# EAGLE design Compass (EAGLE 9.1.2)
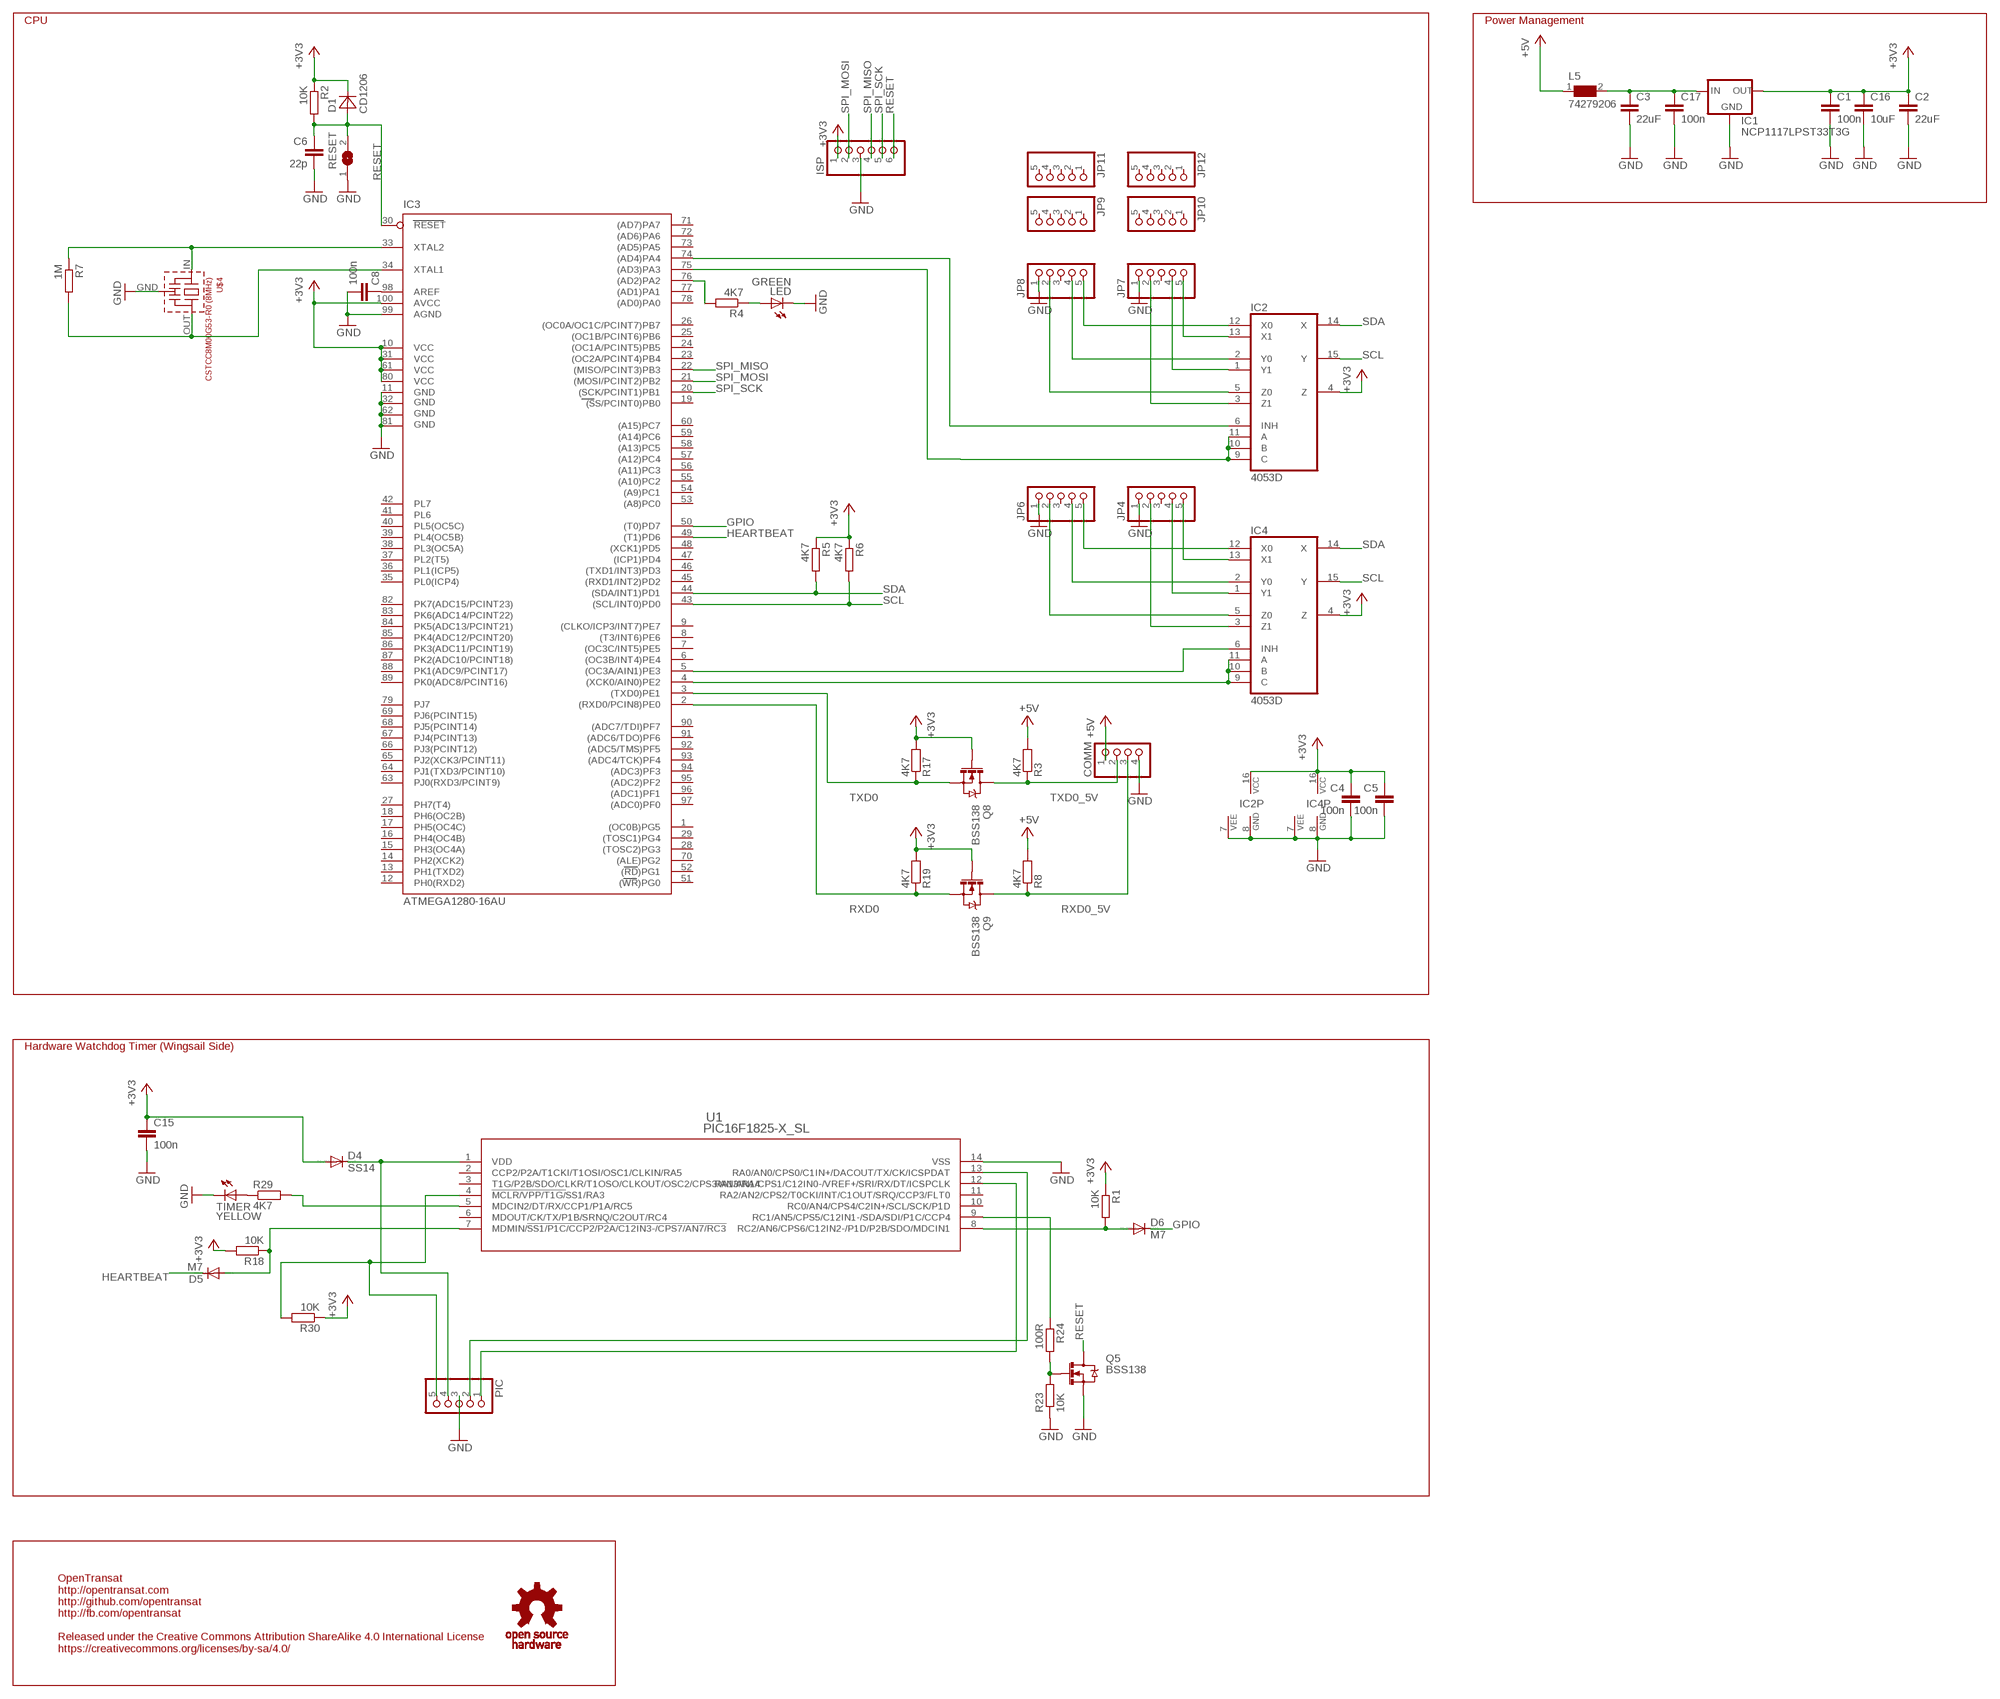
[diagram p0: schematic, sheet 1]

## Parts
C1  100n  C-EUC0603  [C0603]
C2  22uF  C-EUC1210  [C1210]
C3  22uF  C-EUC1210  [C1210]
C4  100n  C-EUC0603  [C0603]
C5  100n  C-EUC0603  [C0603]
C6  22p  C-EUC0603  [C0603]
C8  100n  C-EUC0603  [C0603]
C15  100n  C-EUC0603  [C0603]
C16  10uF  C-EUC1206  [C1206]
C17  100n  C-EUC0603  [C0603]
COMM  PINHD-1X4/90  [1X04/90]
D1  CD1206  [R1206]
D4  SS14  DIODE-DO214AC  [DO214AC]
D5  M7  DIODE-DO-214AC  [DO-214AC]
D6  M7  DIODE-DO-214AC  [DO-214AC]
IC1  NCP1117LPST33T3G  LM1117MP-3.3  [SOT223]
IC2  4053D  [SO16]
IC3  ATMEGA1280-16AU  [TQFP100]
IC4  4053D  [SO16]
ISP  PINHD-1X6/90  [1X06/90]
JP4  PINHD-1X5  [1X05]
JP6  PINHD-1X5  [1X05]
JP7  PINHD-1X5  [1X05]
JP8  PINHD-1X5  [1X05]
JP9  PINHD-1X5  [1X05]
JP10  PINHD-1X5  [1X05]
JP11  PINHD-1X5  [1X05]
JP12  PINHD-1X5  [1X05]
L5  74279206  WE-CBF_0805  [0805]
LED  GREEN  LEDCHIPLED_0805  [CHIPLED_0805]
PIC  PINHD-1X5/90  [1X05/90]
Q5  BSS138  MOSFET-NCHANNEL_SOT23-3  [SOT23-3]
Q8  BSS138  MOSFET-NCHANNEL_SOT23-3  [SOT23-3]
Q9  BSS138  MOSFET-NCHANNEL_SOT23-3  [SOT23-3]
R1  10K  R-EU_R0603  [R0603]
R2  10K  R-EU_R0603  [R0603]
R3  4K7  R-EU_R0603  [R0603]
R4  4K7  R-EU_R0603  [R0603]
R5  4K7  R-EU_R0603  [R0603]
R6  4K7  R-EU_R0603  [R0603]
R7  1M  R-EU_R0603  [R0603]
R8  4K7  R-EU_R0603  [R0603]
R17  4K7  R-EU_R0603  [R0603]
R18  10K  R-EU_R0603  [R0603]
R19  4K7  R-EU_R0603  [R0603]
R23  10K  R-EU_R0603  [R0603]
R24  100R  R-EU_R0603  [R0603]
R29  4K7  R-EU_R0603  [R0603]
R30  10K  R-EU_R0603  [R0603]
RESET  SJW  [SJW]
TIMER  YELLOW  LEDCHIPLED_0805  [CHIPLED_0805]
U1  PIC16F1825-X_SL  [SOIC14-N_MC]
U$1  OSHW_S  [OSHWS]
U$4  CSTCC8M00G53-R0 (8MHz)  CSTCC  [CSTCC]

## Nets
+3V3: C1.1 C2.1 C4.1 C5.1 C15.1 C16.1 D1.2(C) D4.A IC1.2(OUT) IC1.4(OUT) IC2.4(Z) IC2.16(VCC) IC3.10(VCC) IC3.31(VCC1) IC3.61(VCC2) IC3.80(VCC3) IC3.100(AVCC) IC4.4(Z) IC4.16(VCC) ISP.1 Q8.1(G) Q9.1(G) R1.1 R2.1 R5.1 R6.1 R17.2 R18.2 R19.2 R30.1
+5V: COMM.1 L5.1 R3.2 R8.2
GND [1A]: C1.2 C2.2 C3.2 C4.2 C5.2 C6.2 C8.2 C15.2 C16.2 C17.2 COMM.4 IC1.1(GND) IC2.7(VEE) IC2.8(GND) IC3.11(GND) IC3.32(GND1) IC3.62(GND2) IC3.81(GND3) IC3.99(AGND) IC4.7(VEE) IC4.8(GND) ISP.3 JP4.1 JP6.1 JP7.1 JP8.1 LED.C PIC.3 Q5.2(S) R23.1 RESET.1 TIMER.C U1.14(VSS) U$4.GND
GPIO: D6.C IC3.50((T0)PD7)
HEARTBEAT: D5.C IC3.49((T1)PD6)
N$1: C3.1 C17.1 IC1.3(IN) L5.2
N$2: D6.A R1.2 U1.8(RC2/AN6/CPS6/C12IN2-/P1D/P2B/SDO/MDCIN1)
N$3: C8.1 IC3.98(AREF)
N$4: IC4.3(Z1) JP4.2
N$5: LED.A R4.1
N$6: IC4.1(Y1) JP4.4
N$7: IC3.76((AD2)PA2) R4.2
N$10: IC3.4((XCK0/AIN0)PE2) IC4.9(C) IC4.10(B) IC4.11(A)
N$11: IC3.5((OC3A/AIN1)PE3) IC4.6(INH)
N$12: IC4.13(X1) JP4.5
N$13: IC4.12(X0) JP6.5
N$14: IC4.2(Y0) JP6.4
N$15: IC4.5(Z0) JP6.2
N$16: IC2.9(C) IC2.10(B) IC2.11(A) IC3.75((AD3)PA3)
N$17: IC2.6(INH) IC3.74((AD4)PA4)
N$18: IC2.3(Z1) JP7.2
N$19: IC2.1(Y1) JP7.4
N$20: IC2.13(X1) JP7.5
N$21: IC2.12(X0) JP8.5
N$22: IC2.2(Y0) JP8.4
N$23: IC2.5(Z0) JP8.2
N$26: D5.A R18.1 U1.7(MDMIN/!SS1/P1C/CCP2/P2A/C12IN3-/CPS7/AN7/RC3)
N$30: PIC.2 U1.13(RA0/AN0/CPS0/C1IN+/DACOUT/TX/CK/ICSPDAT)
N$36: PIC.5 R30.2 U1.4(!MCLR/VPP/T1G/!SS1/RA3)
N$37: PIC.1 U1.12(RA1/AN1/CPS1/C12IN0-/VREF+/SRI/RX/DT/ICSPCLK)
N$41: D4.C PIC.4 U1.1(VDD)
N$42: R24.1 U1.9(RC1/AN5/CPS5/C12IN1-/SDA/SDI/P1C/CCP4)
N$46: Q5.1(G) R23.2 R24.2
N$51: R29.2 U1.5(MDCIN2/DT/RX/CCP1/P1A/RC5)
N$52: R29.1 TIMER.A
RESET: C6.1 D1.1(A) IC3.30(RESET) ISP.6 Q5.3(D) R2.2 RESET.2
RXD0: IC3.2((RXD0/PCIN8)PE0) Q9.2(S) R19.1
RXD0_5V: COMM.3 Q9.3(D) R8.1
SCL: IC2.15(Y) IC3.43((SCL/INT0)PD0) IC4.15(Y) R6.2
SDA: IC2.14(X) IC3.44((SDA/INT1)PD1) IC4.14(X) R5.2
SPI_MISO: IC3.22((MISO/PCINT3)PB3) ISP.4
SPI_MOSI: IC3.21((MOSI/PCINT2)PB2) ISP.2
SPI_SCK: IC3.20((SCK/PCINT1)PB1) ISP.5
TXD0: IC3.3((TXD0)PE1) Q8.2(S) R17.1
TXD0_5V: COMM.2 Q8.3(D) R3.1
XTAL3: IC3.33(XTAL2) R7.1 U$4.IN
XTAL4: IC3.34(XTAL1) R7.2 U$4.OUT
Unconnected: IC3.1((OC0B)PG5) IC3.6((OC3B/INT4)PE4) IC3.7((OC3C/INT5)PE5) IC3.8((T3/INT6)PE6) IC3.9((CLKO/ICP3/INT7)PE7) IC3.12(PH0(RXD2)) IC3.13(PH1(TXD2)) IC3.14(PH2(XCK2)) IC3.15(PH3(OC4A)) IC3.16(PH4(OC4B)) IC3.17(PH5(OC4C)) IC3.18(PH6(OC2B)) IC3.19((SS/PCINT0)PB0) IC3.23((OC2A/PCINT4)PB4) IC3.24((OC1A/PCINT5)PB5) IC3.25((OC1B/PCINT6)PB6) IC3.26((OC0A/OC1C/PCINT7)PB7) IC3.27(PH7(T4)) IC3.28((TOSC2)PG3) IC3.29((TOSC1)PG4) IC3.35(PL0(ICP4)) IC3.36(PL1(ICP5)) IC3.37(PL2(T5)) IC3.38(PL3(OC5A)) IC3.39(PL4(OC5B)) IC3.40(PL5(OC5C)) IC3.41(PL6) IC3.42(PL7) IC3.45((RXD1/INT2)PD2) IC3.46((TXD1/INT3)PD3) IC3.47((ICP1)PD4) IC3.48((XCK1)PD5) IC3.51((WR)PG0) IC3.52((RD)PG1) IC3.53((A8)PC0) IC3.54((A9)PC1) IC3.55((A10)PC2) IC3.56((A11)PC3) IC3.57((A12)PC4) IC3.58((A13)PC5) IC3.59((A14)PC6) IC3.60((A15)PC7) IC3.63(PJ0(RXD3/PCINT9)) IC3.64(PJ1(TXD3/PCINT10)) IC3.65(PJ2(XCK3/PCINT11)) IC3.66(PJ3(PCINT12)) IC3.67(PJ4(PCINT13)) IC3.68(PJ5(PCINT14)) IC3.69(PJ6(PCINT15)) IC3.70((ALE)PG2) IC3.71((AD7)PA7) IC3.72((AD6)PA6) IC3.73((AD5)PA5) IC3.77((AD1)PA1) IC3.78((AD0)PA0) IC3.79(PJ7) IC3.82(PK7(ADC15/PCINT23)) IC3.83(PK6(ADC14/PCINT22)) IC3.84(PK5(ADC13/PCINT21)) IC3.85(PK4(ADC12/PCINT20)) IC3.86(PK3(ADC11/PCINT19)) IC3.87(PK2(ADC10/PCINT18)) IC3.88(PK1(ADC9/PCINT17)) IC3.89(PK0(ADC8/PCINT16)) IC3.90((ADC7/TDI)PF7) IC3.91((ADC6/TDO)PF6) IC3.92((ADC5/TMS)PF5) IC3.93((ADC4/TCK)PF4) IC3.94((ADC3)PF3) IC3.95((ADC2)PF2) IC3.96((ADC1)PF1) IC3.97((ADC0)PF0) JP4.3 JP6.3 JP7.3 JP8.3 JP9.1 JP9.2 JP9.3 JP9.4 JP9.5 JP10.1 JP10.2 JP10.3 JP10.4 JP10.5 JP11.1 JP11.2 JP11.3 JP11.4 JP11.5 JP12.1 JP12.2 JP12.3 JP12.4 JP12.5 U1.2(CCP2/P2A/T1CKI/T1OSI/OSC1/CLKIN/RA5) U1.3(T1G/P2B/SDO/CLKR/T1OSO/CLKOUT/OSC2/CPS3/AN3/RA4) U1.6(MDOUT/CK/TX/P1B/SRNQ/C2OUT/RC4) U1.10(RC0/AN4/CPS4/C2IN+/SCL/SCK/P1D) U1.11(RA2/AN2/CPS2/T0CKI/INT/C1OUT/SRQ/CCP3/FLT0)

## Notes on the sheet
- CPU | Power Management
- Hardware Watchdog Timer (Wingsail Side)
- OpenTransat
  http://opentransat.com
  http://github.com/opentransat
  http://fb.com/opentransat
  
  Released under the Creative Commons Attribution ShareAlike 4.0 International License
  https://creativecommons.org/licenses/by-sa/4.0/

## Library data of the parts
C1-C6 C8 C15-C17 = rcl:C-EU: CAPACITOR, European symbol; SPICEPREFIX: C
COMM = pinhead:PINHD-1X4: PIN HEADER
D1 = diodes_smd:CD1206
D4-D6 = diode:DIODE-: DIODE
IC1 = lm1117_10:LM1117?-*: 800mA Low-Dropout Linear Regulator Source: http://www.ti.com/lit/ds/symlink/lm1117-n.pdf; MF: Texas Instruments; MPN: LM1117MP-3.3; OC_FARNELL: 9778195; OC_NEWARK: 28X3416
IC2 IC4 = 40xx:4053: Triple 2-channel ANALOG MULTIPLEXER
IC3 = atmel-2005:ATMEGA*: MICROCONTROLLER 64/128/256 Kbytes FLASH 4 Kbytes EEPROM 8 Kbytes SRAM 86 General Purpose I/O pins 12-channels16-bit PWM 4 x Serial USARTs 16-channels 10-bit A/D
ISP = pinhead:PINHD-1X6: PIN HEADER
JP4 JP6-JP12 PIC = pinhead:PINHD-1X5: PIN HEADER
L5 = Wurth_Elektronik_Passive_rev15b:WE-CBF: SMD EMI Suppression Ferrite Beads WE-CBF - Excellent anti-EMI properties - Low DC-restistance - Impedances till 3000 ohms - Rated current up to 6 A -- Reliable Ni-Sn electrodes -- Perfect as data lined filter and for uncoupling of distribution voltage <http://katalog.we-online.de/media/images/eisos/FeCBF_pf2.jpg> Details see: http://katalog.we-online.de/en/pbs/WE-CBF updated by Dan Xu 2014-06-19 2014 (C) Würth Elektronik
LED TIMER = led:LED: LED OSRAM: - CHIPLED LG R971, LG N971, LY N971, LG Q971, LY Q971, LO R971, LY R971 LH N974, LH R974 LS Q976, LO Q976, LY Q976 LO Q996 - Hyper CHIPLED LW Q18S LB Q993, LB Q99A, LB R99A - SideLED LS A670, LO A670, LY A670, LG A670, LP A670 LB A673, LV A673, LT A673, LW A673 LH A674 LY A675 LS A676, LA A676, LO A676, LY A676, LW A676 LS A679, LY A679, LG A679 - Hyper Micro SIDELED® LS Y876, LA Y876, LO Y876, LY Y876 LT Y87S - SmartLED LW L88C, LW L88S LB L89C, LB L89S, LG L890 LS L89K, LO L89K, LY L89K LS L896, LA L896, LO L896, LY L896 - TOPLED LS T670, LO T670, LY T670, LG T670, LP T670 LSG T670, LSP T670, LSY T670, LOP T670, LYG T670 LG T671, LOG T671, LSG T671 LB T673, LV T673, LT T673, LW T673 LH T674 LS T676, LA T676, LO T676, LY T676, LB T676, LH T676, LSB T676, LW T676 LB T67C, LV T67C, LT T67C, LS T67K, LO T67K, LY T67K, LW E67C LS E67B, LA E67B, LO E67B, LY E67B, LB E67C, LV E67C, LT E67C LW T67C LS T679, LY T679, LG T679 LS T770, LO T770, LY T770, LG T770, LP T770 LB T773, LV T773, LT T773, LW T773 LH T774 LS E675, LA E675, LY E675, LS T675 LS T776, LA T776, LO T776, LY T776, LB T776 LHGB T686 LT T68C, LB T68C - Hyper Mini TOPLED® LB M676 - Mini TOPLED Santana® LG M470 LS M47K, LO M47K, LY M47K Source: http://www.osram.convergy.de LUXEON: - LUMILED® LXK2-PW12-R00, LXK2-PW12-S00, LXK2-PW14-U00, LXK2-PW14-V00 LXK2-PM12-R00, LXK2-PM12-S00, LXK2-PM14-U00 LXK2-PE12-Q00, LXK2-PE12-R00, LXK2-PE12-S00, LXK2-PE14-T00, LXK2-PE14-U00 LXK2-PB12-K00, LXK2-PB12-L00, LXK2-PB12-M00, LXK2-PB14-N00, LXK2-PB14-P00, LXK2-PB14-Q00 LXK2-PR12-L00, LXK2-PR12-M00, LXK2-PR14-Q00, LXK2-PR14-R00 LXK2-PD12-Q00, LXK2-PD12-R00, LXK2-PD12-S00 LXK2-PH12-R00, LXK2-PH12-S00 LXK2-PL12-P00, LXK2-PL12-Q00, LXK2-PL12-R00 Source: www.luxeon.com KINGBRIGHT: KA-3528ASYC Source: www.kingbright.com
Q5 Q8 Q9 = Simplex-DiscreteSemi:MOSFET-NCHANNEL: Generic N-channel mosfet
R1-R8 R17-R19 R23 R24 R29 R30 = rcl:R-EU_: RESISTOR, European symbol
RESET = jumper:SJ: SMD solder JUMPER
U1 = PIC16F1825:PIC16F1825-X_SL
U$1 = oshw:OSHW_S
U$4 = murata-cstcc-cstcv-resonators:CSTCC: Murata CSTCC Resonator - 7,2 x 3,0 mm

## Board
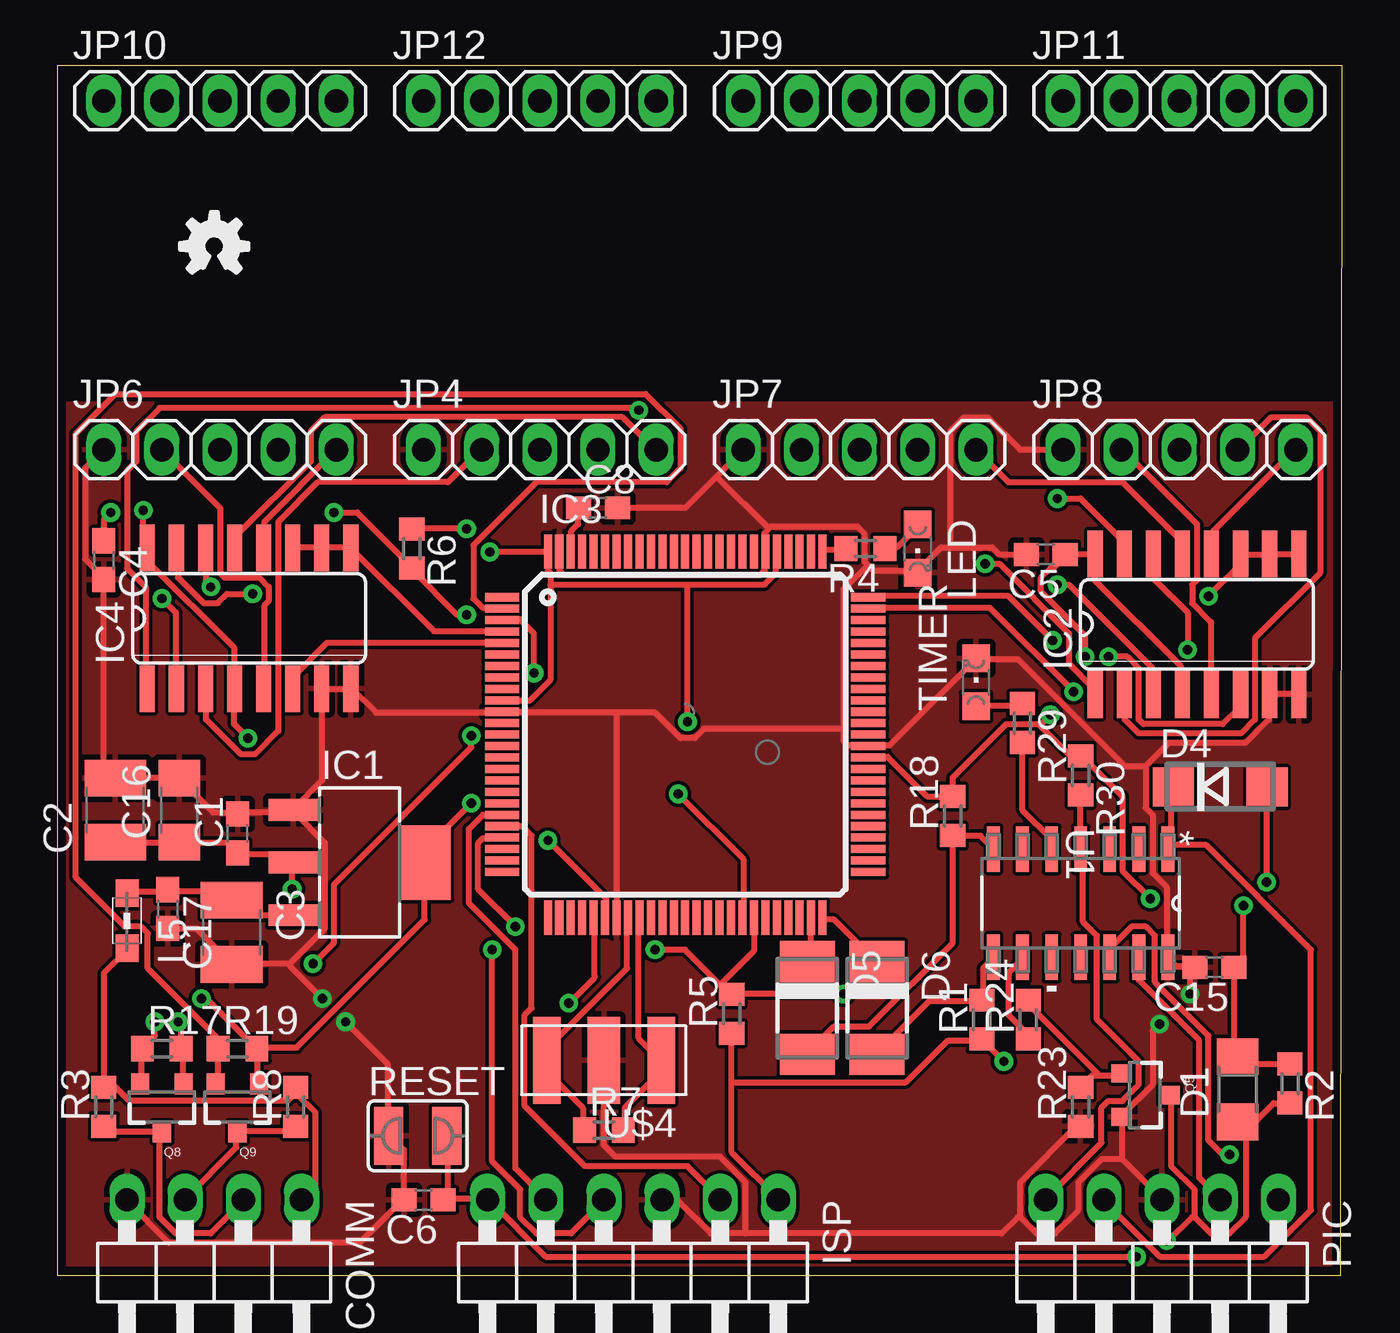
[diagram p1: board, top side]
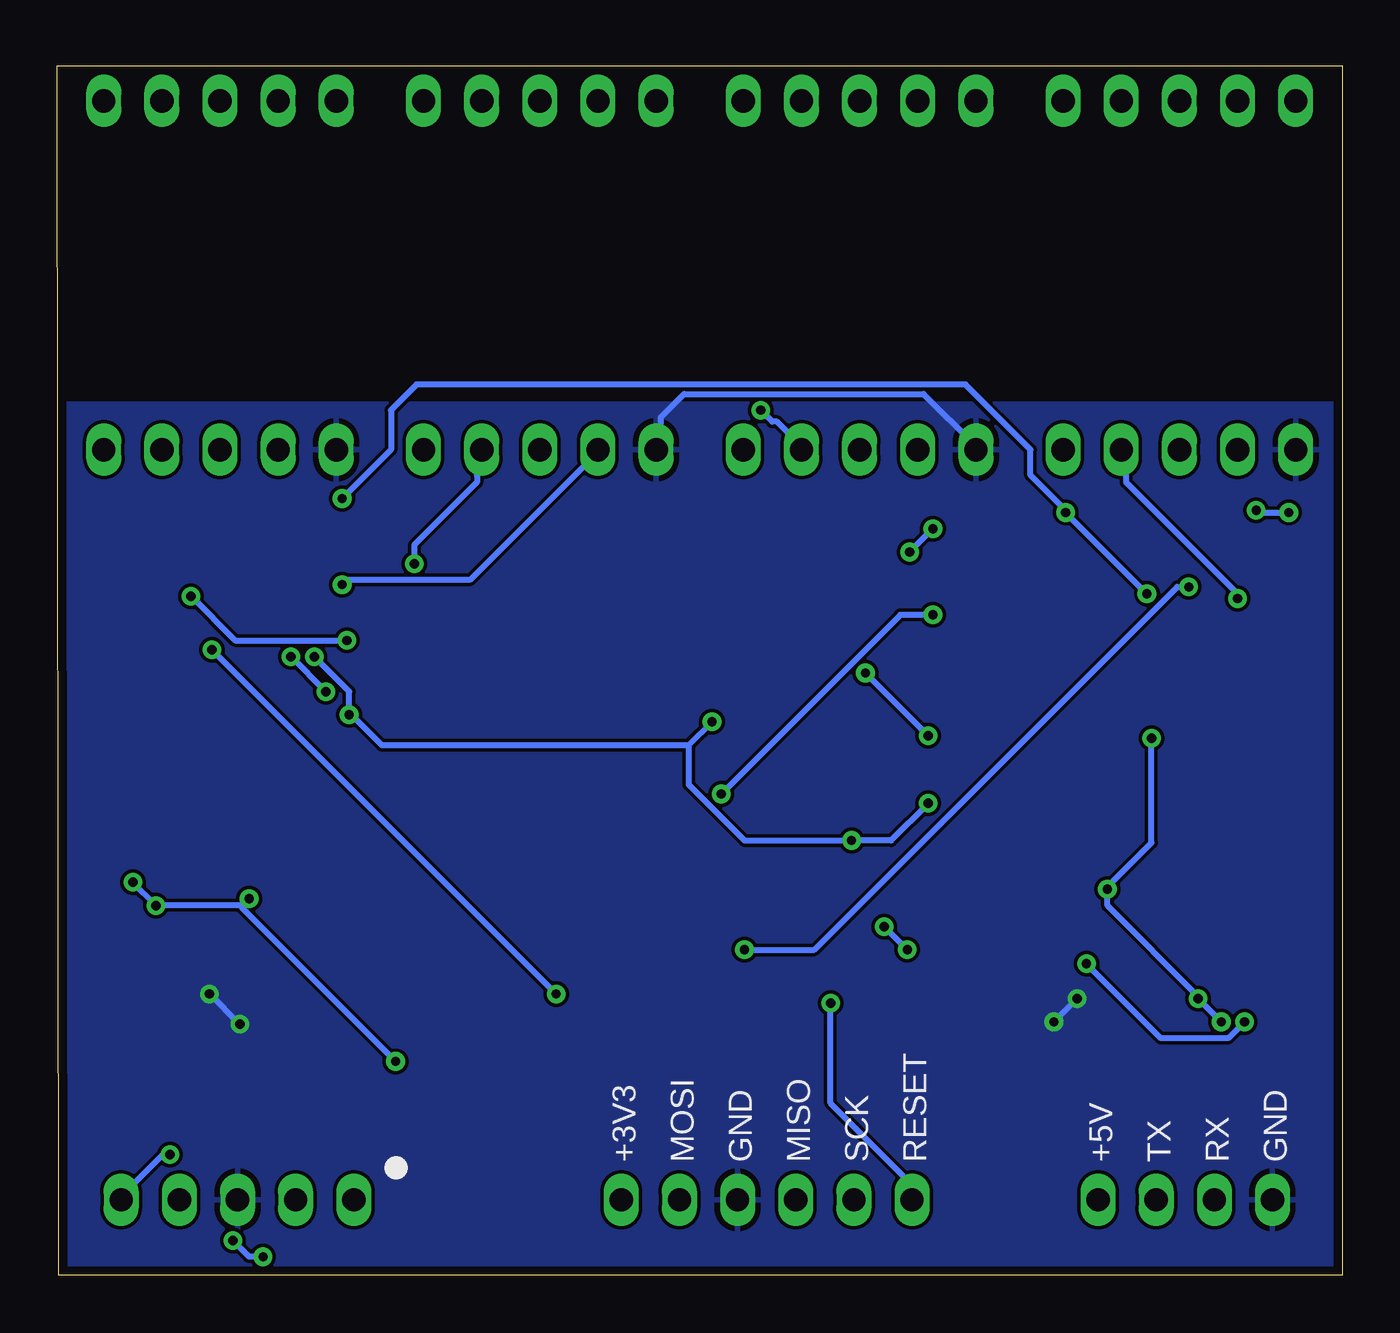
[diagram p2: board, bottom side, seen from below]

Size 56.13 x 52.83 mm. Coordinates in mm from the lower left corner, seen from the top.
Outline: 0,0 56.06,0 56.13,52.83 0,52.83 0,0
Copper layers (1*16): Top 0.035mm / dielectric 1.5mm / Bottom 0.035mm
Design rules "autorouter *": minimum track width 10mil, minimum drill 16mil, track to track 6mil, track to pad 6mil, pad to pad 6mil, via to via 7mil, smd to smd 6mil, copper to edge 15mil, drill to drill 12mil, minimum pad ring 10mil, minimum via ring 8mil, stop-mask expansion 1mil, vias tented up to drill 30mil, thermal gap 10mil

### Footprints (pad centres in the part's own frame; a part is rotated, then mirrored left to right if it is on the bottom)
C0603 = smd 1.1 x 1: 1 -0.85,0; 2 0.85,0
C1210 = smd 1.6 x 2.7: 1 -1.4,0; 2 1.4,0
C1206 = smd 1.6 x 1.8: 1 -1.4,0; 2 1.4,0
1X04/90 = drill 1.016 long: 1 -3.81,-3.81; 2 -1.27,-3.81; 3 1.27,-3.81; 4 3.81,-3.81
R1206 = smd 1.6 x 1.803: 1 -1.422,0; 2 1.422,0
DO214AC = smd 1.8 x 1.7: A 2.05,0; C -2.05,0
DO-214AC = smd 1.8 x 2.4: A 2.025,0; C -2.025,0
SOT223 = smd 0.95 x 2.15: 1 -2.3,-2.9; 2 0,-2.9; 3 2.3,-2.9 | smd 3.25 x 2.15: 4 0,2.9
SO16 = smd 0.66 x 2.032: 1 -4.445,-3.073; 2 -3.175,-3.073; 3 -1.905,-3.073; 4 -0.635,-3.073; 5 0.635,-3.073; 6 1.905,-3.073; 7 3.175,-3.073; 8 4.445,-3.073; 9 4.445,3.073; 10 3.175,3.073; 11 1.905,3.073; 12 0.635,3.073; 13 -0.635,3.073; 14 -1.905,3.073; 15 -3.175,3.073; 16 -4.445,3.073
TQFP100 = smd 1.5 x 0.35: 1 -8,6; 2 -8,5.5; 3 -8,5; 4 -8,4.5; 5 -8,4; 6 -8,3.5; 7 -8,3; 8 -8,2.5; 9 -8,2; 10 -8,1.5; 11 -8,1; 12 -8,0.5; 13 -8,0; 14 -8,-0.5; 15 -8,-1; 16 -8,-1.5; 17 -8,-2; 18 -8,-2.5; 19 -8,-3; 20 -8,-3.5; 21 -8,-4; 22 -8,-4.5; 23 -8,-5; 24 -8,-5.5; 25 -8,-6; 51 8,-6; 52 8,-5.5; 53 8,-5; 54 8,-4.5; 55 8,-4; 56 8,-3.5; 57 8,-3; 58 8,-2.5; 59 8,-2; 60 8,-1.5; 61 8,-1; 62 8,-0.5; 63 8,0; 64 8,0.5; 65 8,1; 66 8,1.5; 67 8,2; 68 8,2.5; 69 8,3; 70 8,3.5; 71 8,4; 72 8,4.5; 73 8,5; 74 8,5.5; 75 8,6 | smd 0.35 x 1.5: 26 -6,-8; 27 -5.5,-8; 28 -5,-8; 29 -4.5,-8; 30 -4,-8; 31 -3.5,-8; 32 -3,-8; 33 -2.5,-8; 34 -2,-8; 35 -1.5,-8; 36 -1,-8; 37 -0.5,-8; 38 0,-8; 39 0.5,-8; 40 1,-8; 41 1.5,-8; 42 2,-8; 43 2.5,-8; 44 3,-8; 45 3.5,-8; 46 4,-8; 47 4.5,-8; 48 5,-8; 49 5.5,-8; 50 6,-8; 76 6,8; 77 5.5,8; 78 5,8; 79 4.5,8; 80 4,8; 81 3.5,8; 82 3,8; 83 2.5,8; 84 2,8; 85 1.5,8; 86 1,8; 87 0.5,8; 88 0,8; 89 -0.5,8; 90 -1,8; 91 -1.5,8; 92 -2,8; 93 -2.5,8; 94 -3,8; 95 -3.5,8; 96 -4,8; 97 -4.5,8; 98 -5,8; 99 -5.5,8; 100 -6,8
1X06/90 = drill 1.016 long: 1 -6.35,-3.81; 2 -3.81,-3.81; 3 -1.27,-3.81; 4 1.27,-3.81; 5 3.81,-3.81; 6 6.35,-3.81
1X05 = drill 1.016 long: 1 -5.08,0; 2 -2.54,0; 3 0,0; 4 2.54,0; 5 5.08,0
0805 = smd 1.2 x 1: 1 -1.2,0; 2 1.2,0
CHIPLED_0805 = smd 1.2 x 1.2: A 0,-1.05; C 0,1.05
1X05/90 = drill 1.016 long: 1 -5.08,-3.81; 2 -2.54,-3.81; 3 0,-3.81; 4 2.54,-3.81; 5 5.08,-3.81
SOT23-3 = smd 0.8 x 0.9: 1 -0.95,-1; 2 0.95,-1; 3 0,1.1
R0603 = smd 1 x 1.1: 1 -0.85,0; 2 0.85,0
SJW = smd 1.27 x 2.54: 1 -1.27,0; 2 1.27,0
SOIC14-N_MC = smd 1.981 x 0.559: 1 -2.362,3.81; 2 -2.362,2.54; 3 -2.362,1.27; 4 -2.362,0; 5 -2.362,-1.27; 6 -2.362,-2.54; 7 -2.362,-3.81; 8 2.362,-3.81; 9 2.362,-2.54; 10 2.362,-1.27; 11 2.362,0; 12 2.362,1.27; 13 2.362,2.54; 14 2.362,3.81
CSTCC = smd 1.4 x 3.8: GND 0,0 | smd 1.2 x 3.8: IN 2.5,0; OUT -2.5,0

### Placement (x,y rotation side)
C1  7.87,19.3 90 top
C2  2.54,20.32 90 top
C3  7.62,14.99 270 top
C4  2.03,31.24 270 top
C5  43.18,31.5 180 top
C6  16,3.3 180 top
C8  23.62,33.53 0 top
C15  50.55,13.46 180 top
C16  5.33,20.32 90 top
C17  4.83,16 270 top
COMM  6.86,-0.51 180 top
D1  51.56,8.13 90 top
D4  50.8,21.34 0 top
D5  32.77,11.68 270 top
D6  35.81,11.68 270 top
IC1  13.21,18.03 270 top
IC2  49.78,28.45 0 top
IC3  27.43,23.62 0 top
IC4  8.38,28.7 0 top
ISP  25.15,-0.51 180 top
JP4  21.08,36.07 0 top
JP6  7.11,36.07 0 top
JP7  35.05,36.07 0 top
JP8  49.02,36.07 0 top
JP9  35.05,51.31 0 top
JP10  7.11,51.31 0 top
JP11  49.02,51.31 0 top
JP12  21.08,51.31 0 top
L5  3.05,15.49 90 top
LED  37.59,31.75 180 top
PIC  48.26,-0.51 180 top
Q5  47.5,7.87 270 top
Q8  4.57,7.37 180 top
Q9  7.87,7.37 180 top
R1  40.39,11.18 90 top
R2  53.85,8.38 270 top
R3  2.03,7.37 90 top
R4  35.31,31.75 180 top
R5  29.46,11.43 90 top
R6  15.49,31.75 270 top
R7  23.88,6.35 0 top
R8  10.41,7.37 90 top
R17  4.57,9.91 0 top
R18  39.12,20.07 90 top
R19  7.87,9.91 0 top
R23  44.7,7.37 90 top
R24  42.42,11.18 90 top
R29  42.16,24.13 270 top
R30  44.7,21.84 270 top
RESET  15.75,6.1 0 top
TIMER  40.13,25.91 0 top
U1  44.7,16.26 270 top
U$1  6.86,44.96 0 top
U$4  23.88,9.4 180 top

### Tracks (layer width: path | path; a pad name or v marks a point on that pad's centre or on a via)
+3V3  (via drill 0.41)
  Top 0.254: C4.1 2.03,33.02 v2.34,33.33 | v3.76,33.43 3.76,31.9 3.86,31.8 IC4.16 3.96,31.7 3.96,31.19 7.72,27.43 7.72,25.7 IC4.4 7.72,25.5 7.72,24.08 v8.33,23.47 | C2.1 2.54,18.9 5.28,18.9 C16.1 5.38,18.9 7.42,18.9 7.82,18.49 C1.1 7.92,18.39 9.96,18.39 10.26,18.09 IC1.2 10.26,17.98 v10.26,16.87 | Q8.1 5.49,8.43 5.49,9.86 R17.2 5.38,9.96 5.38,10.97 v5.28,11.07 | Q9.1 8.74,8.43 8.74,9.86 R19.2 | v6.3,12.09 6.5,12.09 8.64,9.96 R19.2 | R19.2 8.84,9.96 10.46,9.96 16.05,15.54 16.05,17.98 IC1.4 16.15,18.09 16.15,18.69 v18.09,20.62 | v17.88,32.61 15.54,32.61 R6.1 | v18.9,31.6 21.34,31.6 IC3.100 21.44,31.5 21.44,30.79 21.54,30.68 21.54,30.18 | 21.54,30.18 21.54,26.01 20.62,25.09 19.51,25.09 IC3.10 | 21.54,30.18 27.53,30.18 | 27.53,30.18 30.89,30.18 31.39,30.68 31.39,31.6 IC3.80 | 29.46,8.43 29.46,5.38 31.5,3.35 ISP.1 | 29.46,8.43 R5.1 | 29.46,8.43 37.08,8.43 38.91,10.26 40.34,10.26 R1.1 40.44,10.26 v41.35,9.35 | R2.1 53.85,9.25 51.82,9.25 51.61,9.45 D1.2 51.51,9.65 51.41,9.75 51.41,13.41 C15.1 51.51,13.51 51.82,13.82 v51.82,16.15 | v52.83,17.17 52.83,21.34 D4.A | IC2.4 49.07,25.4 49.07,26.62 45.31,30.38 45.31,31.39 IC2.16 45.31,31.5 C5.1 43.99,31.39 43.48,30.89 43.38,30.89 42.98,30.48 42.98,29.87 44.91,27.94 v44.91,27.03 | IC3.61 35.46,22.66 36.27,22.66 38,20.93 R18.2 39.12,21.74 41.45,24.08 42.88,24.08 42.93,24.03 | 42.93,24.03 44.2,22.76 44.7,22.76 R30.1 44.81,22.66 46.53,20.93 46.53,17.68 v47.75,16.46 | 42.93,24.03 v43.38,24.49 | v27.53,24.18 27.53,30.18 | v21.44,19 23.98,16.46 23.98,15.65 IC3.31
  Bottom 0.254: v2.34,33.33 3.66,33.33 v3.76,33.43 | v5.28,11.07 v6.3,12.09 6.3,12.19 10.26,16.15 v10.26,16.87 10.26,16.97 8.33,18.9 v8.33,23.47 | v18.9,31.6 v17.88,32.61 | v52.83,17.17 v51.82,16.15 48.06,16.15 | v44.91,27.03 43.38,25.5 v43.38,24.49 43.28,24.49 41.96,23.16 28.65,23.16 28.55,23.16 | v47.75,16.46 48.06,16.15 | v41.35,9.35 48.06,16.05 48.06,16.15 | v18.09,20.62 19.71,19 v21.44,19 21.54,19 26.11,19 28.55,21.44 28.55,21.54 28.55,23.16 | v27.53,24.18 28.55,23.16
+5V
  Top 0.254: L5.1 3.05,14.22 2.03,13.21 R3.2 2.13,8.23 2.54,8.23 3.15,7.62 10.06,7.62 10.36,7.92 R8.2 10.46,8.13 10.46,7.92 11.28,7.11 11.28,3.96 10.67,3.35 COMM.1
GND  (via drill 0.41)
  Top 0.254: COMM.4 3.05,3.25 4.88,1.42 13.21,1.42 15.04,3.25 C6.2 15.14,3.35 15.14,5.49 14.53,6.1 RESET.1 14.43,6.2 14.43,9.25 v12.6,11.07 | JP6.1 1.22,35.26 1.22,31.29 2.03,30.48 C4.2 2.03,22.35 2.54,21.84 C2.2 2.54,21.74 5.28,21.74 C16.2 5.38,21.64 6.81,20.22 7.82,20.22 C1.2 7.92,20.22 10.16,20.22 10.26,20.32 IC1.1 | C17.2 4.88,15.14 6.1,15.14 7.62,13.61 C3.2 7.72,13.61 10.16,13.61 | 10.16,13.61 11.68,15.14 11.68,18.9 10.36,20.22 IC1.1 | IC1.1 10.36,20.42 11.58,21.64 11.58,25.5 IC4.7 11.58,25.6 12.7,25.6 IC4.8 12.9,25.6 13.92,24.59 19.41,24.59 IC3.11 19.51,24.59 24.38,24.59 | v11.58,12.09 10.16,13.51 10.16,13.61 | 46.53,5.08 46.53,6.91 Q5.2 46.53,7.01 47.85,8.33 47.85,10.67 v48.16,10.97 | 46.53,5.08 48.26,3.35 PIC.3 | 42.06,2.54 42.06,4.06 44.5,6.5 44.7,6.5 R23.1 | 42.06,2.54 42.77,1.83 43.59,1.83 44.6,2.85 44.6,4.06 45.62,5.08 46.53,5.08 | 30.07,1.83 41.25,1.83 41.96,2.54 42.06,2.54 | 30.07,1.83 28.55,1.83 27.13,3.25 26.42,3.25 ISP.3 | U$4.GND 23.88,5.69 24.38,5.18 28.96,5.18 30.07,4.06 30.07,1.83 | C8.2 27.43,33.53 28.8,34.9 | JP7.1 28.8,34.9 | IC2.8 54.15,25.4 53.03,25.4 IC2.7 52.93,25.3 52.93,24.28 51.92,23.27 48.56,23.27 47.55,22.25 | 47.55,22.25 47.55,20.42 47.85,20.12 47.85,17.58 48.46,16.97 48.46,13.92 U1.14 48.56,13.82 48.87,13.51 49.68,13.51 C15.2 49.48,13.41 v49.48,12.29 | C5.2 41.15,31.5 40.84,31.8 39.01,31.8 | 39.01,31.8 38.61,31.8 37.59,30.79 LED.C 37.49,30.79 35.66,30.79 35.41,31.04 | IC3.99 21.95,31.6 21.95,30.79 22.15,30.58 30.68,30.58 30.89,30.79 30.89,31.6 IC3.81 30.89,31.7 30.89,32.41 31.09,32.61 | 35.41,31.04 35.26,31.19 35.26,32.41 34.95,32.72 31.19,32.72 31.09,32.61
  Top 0.254: JP8.1 42.06,36.07 40.64,37.49 39.62,37.49 39.01,36.88 39.01,31.8 | 34.34,23.88 34.34,29.97 35.41,31.04 | 34.34,23.88 34.34,23.37 34.54,23.16 35.36,23.16 IC3.62 35.46,23.16 36.37,23.16 40.13,26.92 TIMER.C 40.23,26.92 41.96,26.92 46.63,22.25 47.55,22.25 | 31.09,32.61 28.8,34.9 | 24.38,24.59 26.11,24.59 27.23,23.47 27.84,23.47 28.25,23.88 34.34,23.88 | 24.38,24.59 24.43,24.54 IC3.32
  Bottom 0.254: v11.58,12.09 v12.6,11.07 | JP7.1 29.97,36.98 29.77,37.19 29.77,37.49 28.75,38.51 18.29,38.51 16.05,36.27 16.05,36.07 JP4.1 | v49.48,12.29 v48.16,10.97
  pour Bottom: -5.59,38.1 61.98,38.1 61.98,-4.06 -5.59,-4.06
  pour Top: -7.11,38.1 64.01,38.1 64.01,-5.59 -7.11,-5.59
GPIO
  Top 0.254: IC3.50 33.53,15.54 33.93,15.54 35.76,13.72 D6.C
HEARTBEAT
  Top 0.254: IC3.49 32.92,15.54 32.92,13.82 32.82,13.72 D5.C
N$1
  Top 0.254: L5.2 3.05,16.76 4.78,16.76 C17.1 4.88,16.76 7.32,16.76 7.62,16.46 C3.1 7.72,16.36 8.33,15.75 10.26,15.75 IC1.3
N$2
  Top 0.254: U1.8 40.84,13.82 40.44,13.41 40.44,12.09 R1.2 40.34,11.99 38.1,11.99 35.87,9.75 D6.A
N$3
  Top 0.254: C8.1 22.76,33.53 22.76,32.82 22.45,32.51 22.45,31.7 IC3.98
N$4
  Top 0.254: IC4.3 6.5,25.6 6.5,24.28 8.03,22.76 8.64,22.76 9.65,23.77 9.65,32.92 11.38,34.65 17.07,34.65 18.49,36.07 JP4.2
N$5
  Top 0.254: R4.1 36.17,31.8 36.68,31.8 37.59,32.72 LED.A
N$6  (via drill 0.41)
  Top 0.254: v25.4,37.8 25.3,37.9 4.47,37.9 3.45,36.88 3.45,35.56 3.05,35.15 3.05,30.89 3.86,30.07 3.86,25.7 IC4.1
  Bottom 0.254: v25.4,37.8 24.89,37.29 24.69,37.29 23.67,36.27 23.67,36.07 JP4.4
N$7
  Top 0.254: R4.2 34.44,31.7 33.53,31.7 IC3.76
N$10
  Top 0.254: IC4.11 10.36,31.8 11.48,31.8 IC4.10 11.68,31.8 12.8,31.8 IC4.9 16.46,28.14 19.41,28.14 IC3.4
N$11
  Top 0.254: IC3.5 19.41,27.64 11.79,27.64 10.36,26.21 10.36,25.7 IC4.6
N$12
  Top 0.254: IC4.13 7.82,31.8 7.82,32.31 11.07,35.56 11.07,36.88 11.68,37.49 24.69,37.49 26.11,36.07 JP4.5
N$13
  Top 0.254: JP6.5 9.04,32.92 9.04,31.8 IC4.12
N$14  (via drill 0.41)
  Top 0.254: v4.57,29.57 5.18,28.96 5.18,25.7 IC4.2
  Bottom 0.254: v4.57,29.57 4.57,29.77 9.45,34.65 9.45,34.95 9.65,35.15 JP6.4
N$15
  Top 0.254: JP6.2 7.11,33.53 7.11,30.68 7.32,30.48 8.84,30.48 9.25,30.07 9.25,29.46 9.04,29.26 9.04,25.7 IC4.5
N$16  (via drill 0.41)
  Top 0.254: IC2.9 54.15,31.5 53.03,31.5 IC2.10 52.83,31.5 51.82,31.5 IC2.11 51.61,31.5 51.61,30.99 v50.29,29.67 | v43.48,27.74 41.55,29.67 35.46,29.67 IC3.75
  Bottom 0.254: v43.48,27.74 48.36,27.74 v50.29,29.67
N$17  (via drill 0.41)
  Top 0.254: v44.4,25.5 40.74,29.16 35.46,29.16 IC3.74 | v45.92,27.03 46.74,27.03 47.24,26.52 47.24,24.28 47.45,24.08 50.9,24.08 51.61,24.79 51.61,25.3 IC2.6
  Bottom 0.254: v45.92,27.03 v44.4,25.5
N$18  (via drill 0.41)
  Top 0.254: v43.69,30.18 44.2,30.18 47.85,26.52 47.85,25.4 IC2.3
  Bottom 0.254: v43.69,30.18 43.48,30.38 38.1,30.38 32.51,35.97 JP7.2
N$19  (via drill 0.41)
  Top 0.254: v40.54,31.09 41.15,31.09 44.2,28.04 44.2,26.72 45.31,25.6 45.31,25.4 IC2.1
  Bottom 0.254: v40.54,31.09 40.54,31.9 37.8,34.65 37.8,34.95 37.59,35.15 JP7.4
N$20
  Top 0.254: JP7.5 41.55,34.65 46.53,34.65 49.07,32.11 49.07,31.6 IC2.13
N$21
  Top 0.254: IC2.12 50.49,31.6 50.49,32.51 54.05,36.07 JP8.5
N$22
  Top 0.254: IC2.2 46.63,25.3 46.63,24.28 47.24,23.67 51.71,23.67 52.32,24.28 52.32,27.84 55.17,30.68 55.17,36.88 54.56,37.49 53.03,37.49 51.61,36.07 JP8.4
N$23
  Top 0.254: IC2.5 50.39,25.4 50.39,28.55 49.58,29.36 49.58,30.18 49.78,30.38 49.78,32.82 46.53,36.07 JP8.2
N$26
  Top 0.254: U1.7 40.84,18.69 40.34,19.2 39.12,19.2 R18.1 39.12,14.53 35.46,10.87 33.93,10.87 32.82,9.75 D5.A
N$30
  Top 0.254: U1.13 47.24,12.9 49.89,10.26 49.89,4.27 50.8,3.35 PIC.2
N$36
  Top 0.254: R30.2 U1.4 44.81,18.59 44.81,15.44 45.41,14.83 45.41,11.18 47.24,9.35 47.24,8.33 46.53,7.62 45.92,7.62 45.62,7.32 45.62,5.79 43.18,3.35 PIC.5
N$37  (via drill 0.41)
  Top 0.254: v51.21,5.28 50.9,5.28 50.29,5.89 50.29,10.46 47.95,12.8 47.95,14.83 47.55,15.24 46.94,15.24 46.02,14.33 46.02,13.92 U1.12
  Bottom 0.254: v51.21,5.28 51.51,5.28 53.34,3.45 PIC.1
N$41
  Top 0.254: D4.C 48.67,21.34 48.67,18.8 48.56,18.69 U1.1 48.77,18.8 50.19,18.8 54.76,14.22 54.76,2.85 52.73,0.81 48.16,0.81 45.72,3.25 PIC.4
N$42
  Top 0.254: R24.1 42.37,10.36 42.37,10.57 41.55,11.38 41.55,13.21 42.16,13.82 U1.9
N$46
  Top 0.254: 45.41,8.74 45.21,8.74 R23.2 | 45.41,8.74 46.43,8.74 Q5.1 | R24.2 42.47,11.99 42.47,11.79 45.41,8.84 45.41,8.74
N$51
  Top 0.254: R29.2 42.16,20.32 43.38,19.1 43.38,18.69 U1.5
N$52
  Top 0.254: R29.1 42.16,24.89 40.13,24.89 TIMER.A
RESET  (via drill 0.41)
  Top 0.254: 49.68,2.54 49.68,3.76 48.67,4.78 48.67,7.82 Q5.3 | 49.68,2.54 50.39,1.83 51.21,1.83 51.92,2.54 51.92,6.4 51.61,6.71 D1.1 52.02,6.4 53.14,7.52 53.85,7.52 R2.2 | v22.35,11.89 23.47,13.01 23.47,13.11 23.47,15.54 IC3.30 | RESET.2 17.07,6.1 17.07,3.45 C6.1 16.87,3.35 18.8,3.35 ISP.6 18.9,3.25 21.34,0.81 v47.14,0.81 | v48.46,1.52 48.56,1.52 49.58,2.54 49.68,2.54
  Bottom 0.254: v22.35,11.89 22.35,7.52 18.8,3.96 ISP.6 | v48.46,1.52 47.75,0.81 v47.14,0.81
RXD0
  Top 0.254: Q9.2 7.01,8.43 7.01,9.86 R19.1 6.91,9.96 6.91,10.46 3.96,13.41 3.96,14.94 3.66,15.24 2.95,15.24 0.81,17.37 0.81,36.78 2.54,38.51 25.7,38.51 27.23,36.98 27.23,35.26 26.62,34.65 20.93,34.65 18.19,31.9 18.19,29.57 18.59,29.16 19.41,29.16 IC3.2
RXD0_5V
  Top 0.254: R8.1 10.36,6.5 10.16,6.3 7.92,6.3 Q9.3 7.82,6.2 7.82,5.59 5.59,3.35 COMM.3
SCL  (via drill 0.41)
  Top 0.254: v12.09,33.33 13.11,33.33 15.44,30.99 R6.2 15.54,30.79 17.48,28.85 v17.88,28.85 | v8.53,29.77 7.42,29.77 7.01,29.36 6.4,29.36 5.28,30.48 5.28,31.7 IC4.15 | v27.13,21.03 29.97,18.19 29.97,15.65 IC3.43 | v43.69,33.93 44.7,33.93 46.53,32.11 46.53,31.6 IC2.15
  Bottom 0.254: v8.53,29.77 v12.09,33.33 12.09,33.43 13.61,34.95 13.61,36.07 16.46,38.91 40.44,38.91 41.55,37.8 41.55,36.07 v43.69,33.93 | v27.13,21.03 19.3,28.85 v17.88,28.85
SDA  (via drill 0.41)
  Top 0.254: v34.34,12.29 29.46,12.29 R5.2 29.36,12.29 28.96,12.7 | v49.38,27.33 49.38,28.96 47.95,30.38 47.95,31.5 IC2.14 | v6.71,30.07 6.5,30.28 6.5,31.7 IC4.14 | v26.11,14.22 27.43,14.22 28.96,12.7 | IC3.44 30.43,14.18 28.96,12.7
  Bottom 0.254: v49.38,27.33 v34.34,12.29 | v6.71,30.07 7.21,30.07 23.06,14.22 v26.11,14.22
SPI_MISO  (via drill 0.41)
  Top 0.254: v20.02,15.24 18.39,16.87 18.39,18.9 18.59,19.1 19.41,19.1 IC3.22 | v19,14.22 19,4.98 20.22,3.76 20.22,2.54 20.93,1.83 22.45,1.83 23.88,3.25 ISP.4
  Bottom 0.254: v19,14.22 v20.02,15.24
SPI_MOSI
  Top 0.254: IC3.21 19.51,19.61 20.32,19.61 20.73,19.2 20.73,11.68 20.42,11.38 20.42,7.42 23.06,4.78 27.53,4.78 28.96,3.35 ISP.2
SPI_SCK
  Top 0.254: IC3.20 19.41,20.12 18.59,20.12 17.98,19.51 17.98,16.26 20.02,14.22 20.02,4.67 21.34,3.35 ISP.5
TXD0  (via drill 0.41)
  Top 0.254: Q8.2 3.66,8.43 3.66,9.86 R17.1 3.76,9.96 4.27,10.46 v4.27,11.07 | v20.83,26.31 20.83,28.04 20.22,28.65 19.51,28.65 IC3.3 | v18.09,23.57 18.09,23.06 12.09,17.07 12.09,14.53 v11.18,13.61
  Bottom 0.254: v18.09,23.57 v20.83,26.31 | v11.18,13.61 7.92,10.36 4.98,10.36 v4.27,11.07
TXD0_5V
  Top 0.254: R3.1 2.03,6.5 2.23,6.3 4.57,6.3 Q8.3 4.47,6.2 4.47,2.54 5.18,1.83 6.71,1.83 8.13,3.25 COMM.2
XTAL3
  Top 0.254: R7.1 22.96,6.4 22.96,7.32 21.44,8.84 21.44,9.35 U$4.IN 21.44,9.45 21.44,9.96 24.89,13.41 24.89,15.54 IC3.33
XTAL4
  Top 0.254: R7.2 24.79,6.4 24.79,7.32 26.31,8.84 26.31,9.35 U$4.OUT 26.31,9.45 25.4,10.36 25.4,15.54 IC3.34

### Text on the board
_bsilk: GND | RX | TX | +5V | RESET | SCK | MISO | GND | MOSI | +3V3